# EAGLE design LinearMixer (EAGLE 9.6.1)
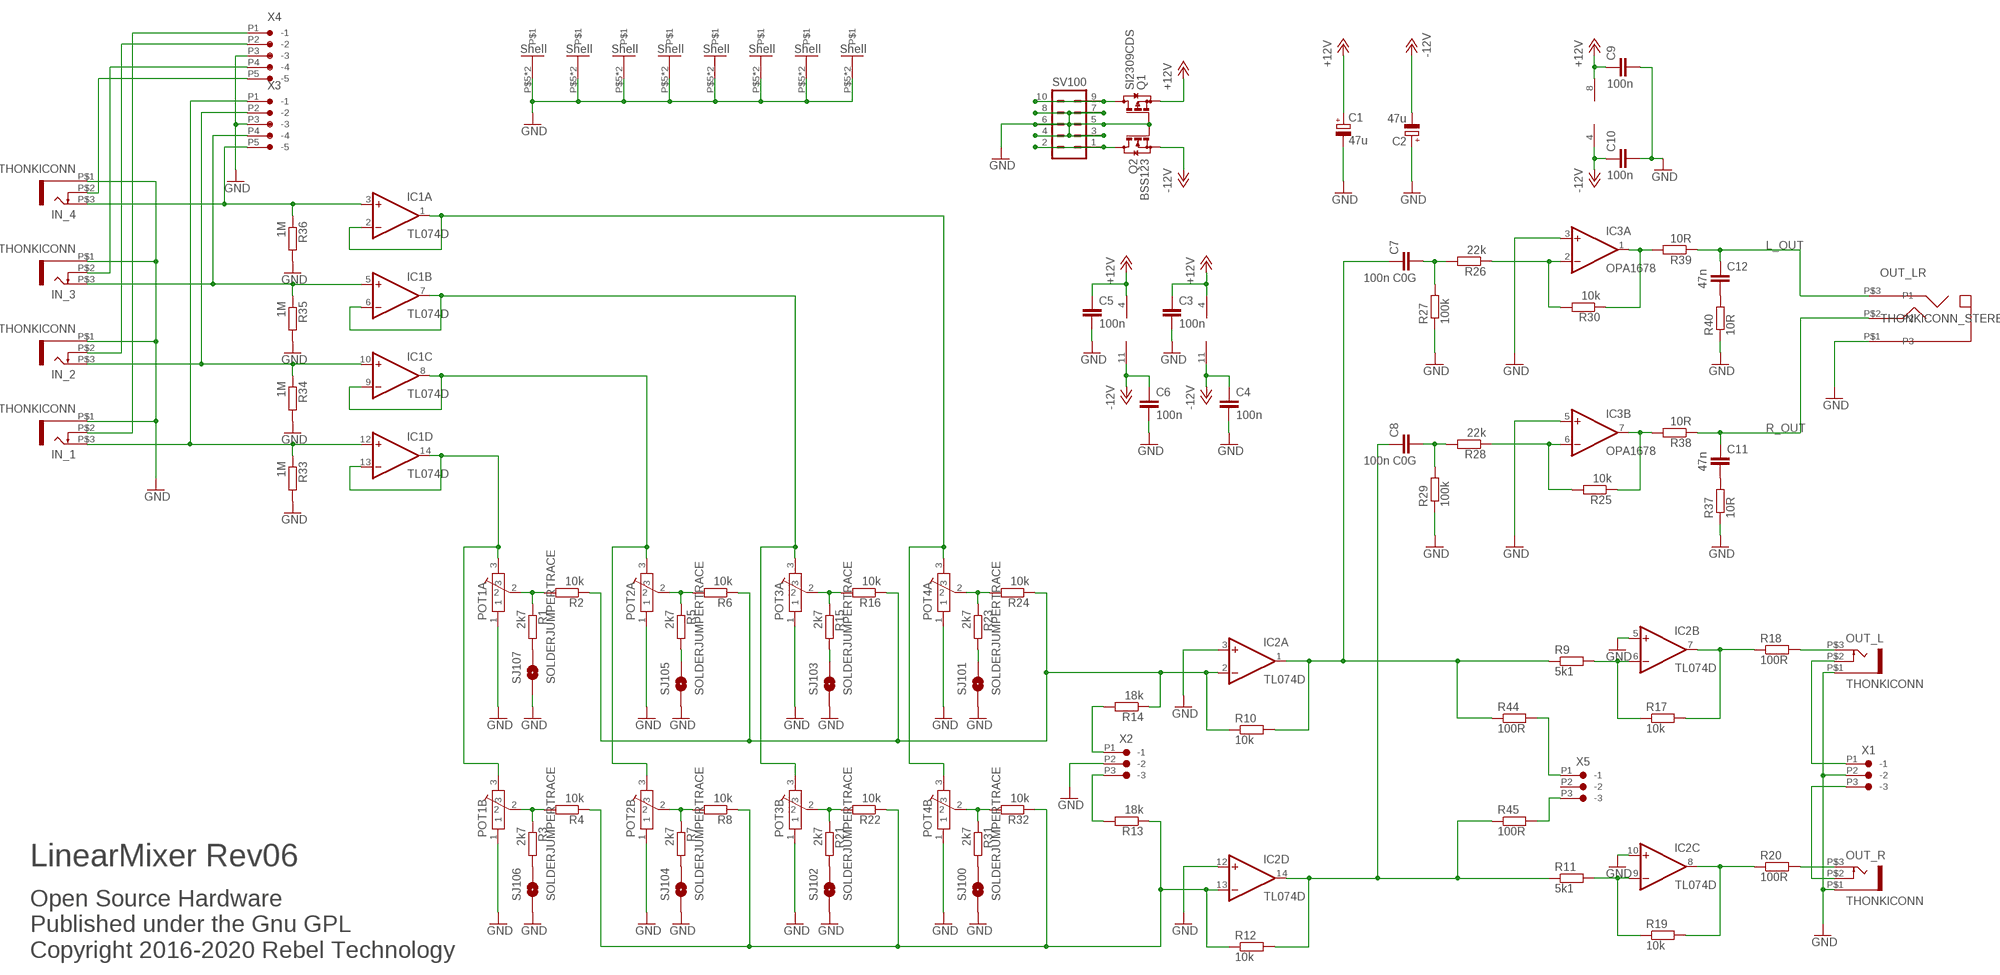
[diagram p0: schematic, sheet 1]

## Parts
C1  47u  CPOL-EU153CLV-0505  [153CLV-0505]
C2  47u  CPOL-EU153CLV-0505  [153CLV-0505]
C3  100n  C-EUC0603  [C0603]
C4  100n  C-EUC0603  [C0603]
C5  100n  C-EUC0603  [C0603]
C6  100n  C-EUC0603  [C0603]
C7  100n C0G  C-EUC1210  [C1210]
C8  100n C0G  C-EUC1210  [C1210]
C9  100n  C-EUC0603  [C0603]
C10  100n  C-EUC0603  [C0603]
C11  47n  C-EUC0603  [C0603]
C12  47n  C-EUC0603  [C0603]
IC1  TL074D  [SO14]
IC2  TL074D  [SO14]
IC3  OPA1678  NE5532D  [SO08]
IN_1  THONKICONN  [THONKICONN]
IN_2  THONKICONN  [THONKICONN]
IN_3  THONKICONN  [THONKICONN]
IN_4  THONKICONN  [THONKICONN]
OUT_L  THONKICONN  [THONKICONN]
OUT_LR  THONKICONN_STEREO  [THONKICONN_STEREO]
OUT_R  THONKICONN  [THONKICONN]
POT1A  POT-ALPS-RK09L1140  [POT-ALPS-RK09L1140]
POT1B  POT-ALPS-RK09L1140  [POT-ALPS-RK09L1140]
POT2A  POT-ALPS-RK09L1140  [POT-ALPS-RK09L1140]
POT2B  POT-ALPS-RK09L1140  [POT-ALPS-RK09L1140]
POT3A  POT-ALPS-RK09L1140  [POT-ALPS-RK09L1140]
POT3B  POT-ALPS-RK09L1140  [POT-ALPS-RK09L1140]
POT4A  POT-ALPS-RK09L1140  [POT-ALPS-RK09L1140]
POT4B  POT-ALPS-RK09L1140  [POT-ALPS-RK09L1140]
Q1  SI2309CDS  BSS84  [SOT23]
Q2  BSS123  [SOT23]
R1  2k7  R-EU_0603  [0603]
R2  10k  R-EU_0603  [0603]
R3  2k7  R-EU_0603  [0603]
R4  10k  R-EU_0603  [0603]
R5  2k7  R-EU_0603  [0603]
R6  10k  R-EU_0603  [0603]
R7  2k7  R-EU_0603  [0603]
R8  10k  R-EU_0603  [0603]
R9  5k1  R-EU_0603  [0603]
R10  10k  R-EU_0603  [0603]
R11  5k1  R-EU_0603  [0603]
R12  10k  R-EU_0603  [0603]
R13  18k  R-EU_0603  [0603]
R14  18k  R-EU_0603  [0603]
R15  2k7  R-EU_0603  [0603]
R16  10k  R-EU_0603  [0603]
R17  10k  R-EU_0603  [0603]
R18  100R  R-EU_0603  [0603]
R19  10k  R-EU_0603  [0603]
R20  100R  R-EU_0603  [0603]
R21  2k7  R-EU_0603  [0603]
R22  10k  R-EU_0603  [0603]
R23  2k7  R-EU_0603  [0603]
R24  10k  R-EU_0603  [0603]
R25  10k  R-EU_0603  [0603]
R26  22k  R-EU_0603  [0603]
R27  100k  R-EU_0603  [0603]
R28  22k  R-EU_0603  [0603]
R29  100k  R-EU_0603  [0603]
R30  10k  R-EU_0603  [0603]
R31  2k7  R-EU_0603  [0603]
R32  10k  R-EU_0603  [0603]
R33  1M  R-EU_0603  [0603]
R34  1M  R-EU_0603  [0603]
R35  1M  R-EU_0603  [0603]
R36  1M  R-EU_0603  [0603]
R37  10R  R-EU_0603  [0603]
R38  10R  R-EU_0603  [0603]
R39  10R  R-EU_0603  [0603]
R40  10R  R-EU_0603  [0603]
R44  100R  R-EU_0603  [0603]
R45  100R  R-EU_0603  [0603]
SJ100  SOLDERJUMPERTRACE  [SJ_2S-TRACE]
SJ101  SOLDERJUMPERTRACE  [SJ_2S-TRACE]
SJ102  SOLDERJUMPERTRACE  [SJ_2S-TRACE]
SJ103  SOLDERJUMPERTRACE  [SJ_2S-TRACE]
SJ104  SOLDERJUMPERTRACE  [SJ_2S-TRACE]
SJ105  SOLDERJUMPERTRACE  [SJ_2S-TRACE]
SJ106  SOLDERJUMPERTRACE  [SJ_2S-TRACE]
SJ107  SOLDERJUMPERTRACE  [SJ_2S-TRACE]
SV100  MA05-2  [MA05-2]
X1  CON-JST_PH_3W  [CON-JST_PH_3W]
X2  CON-JST_PH_3W  [CON-JST_PH_3W]
X3  CON-JST_PH_5W  [CON-JST_PH_5W]
X4  CON-JST_PH_5W  [CON-JST_PH_5W]
X5  CON-JST_PH_3W  [CON-JST_PH_3W]

## Nets
+12V: C1.+ C3.1 C5.1 C9.1 IC1.4(P:V+) IC2.4(P:V+) IC3.8(P:V+) Q1.2(S)
-12V: C2.- C4.1 C6.1 C10.1 IC1.11(P:V-) IC2.11(P:V-) IC3.4(P:V-) Q2.2(S)
GND: C1.- C2.+ C3.2 C4.2 C5.2 C6.2 C9.2 C10.2 IC2.3(A:+IN) IC2.5(B:+IN) IC2.10(C:+IN) IC2.12(D:+IN) IC3.3(A:+IN) IC3.5(B:+IN) IN_1.P$1 IN_2.P$1 IN_3.P$1 IN_4.P$1 OUT_L.P$1 OUT_LR.P$1(P3) OUT_R.P$1 POT1A.1 POT1A.P$5 POT1A.P$6 POT1B.1 POT1B.P$5 POT1B.P$6 POT2A.1 POT2A.P$5 POT2A.P$6 POT2B.1 POT2B.P$5 POT2B.P$6 POT3A.1 POT3A.P$5 POT3A.P$6 POT3B.1 POT3B.P$5 POT3B.P$6 POT4A.1 POT4A.P$5 POT4A.P$6 POT4B.1 POT4B.P$5 POT4B.P$6 Q1.1(G) Q2.1(G) R27.1 R29.1 R33.2 R34.2 R35.2 R36.2 R37.1 R40.1 SJ100.1 SJ101.1 SJ102.1 SJ103.1 SJ104.1 SJ105.1 SJ106.1 SJ107.1 SV100.3 SV100.4 SV100.5 SV100.6 SV100.7 SV100.8 X1.P2(-2) X2.P2(-2) X3.P3(-3) X4.P3(-3)
IN_1: IC1.12(D:+IN) IN_1.P$3 R33.1 X3.P1(-1)
IN_2: IC1.10(C:+IN) IN_2.P$3 R34.1 X3.P2(-2)
IN_3: IC1.5(B:+IN) IN_3.P$3 R35.1 X3.P4(-4)
IN_4: IC1.3(A:+IN) IN_4.P$3 R36.1 X3.P5(-5)
IN_A: R14.2 X2.P1(-1)
IN_B: R13.2 X2.P3(-3)
IN_SW_1: IN_1.P$2 X4.P1(-1)
IN_SW_2: IN_2.P$2 X4.P2(-2)
IN_SW_3: IN_3.P$2 X4.P4(-4)
IN_SW_4: IN_4.P$2 X4.P5(-5)
L_OUT: C12.1 OUT_LR.P$3(P1) R39.1
N$1: Q2.3(D) SV100.1 SV100.2
N$2: IC3.7(B:OUT) R25.1 R38.2
N$3: IC3.2(A:-IN) R26.1 R30.2
N$4: C8.2 R28.2 R29.2
N$5: IC2.8(C:OUT) R19.2 R20.1
N$6: IC2.7(B:OUT) R17.2 R18.1
N$7: IC2.13(D:-IN) R4.1 R8.1 R12.1 R13.1 R22.1 R32.1
N$8: C7.2 R26.2 R27.2
N$9: OUT_L.P$3 R18.2
N$10: C8.1 IC2.14(D:OUT) R11.1 R12.2 R45.1
N$11: IC2.2(A:-IN) R2.1 R6.1 R10.1 R14.1 R16.1 R24.1
N$12: C11.2 R37.2
N$13: C7.1 IC2.1(A:OUT) R9.1 R10.2 R44.1
N$14: Q1.3(D) SV100.9 SV100.10
N$15: OUT_R.P$3 R20.2
N$16: IC3.6(B:-IN) R25.2 R28.1
N$17: R1.2 SJ107.2
N$18: IC2.6(B:-IN) R9.2 R17.1
N$19: IC3.1(A:OUT) R30.1 R39.2
N$20: POT1B.2 R3.1 R4.2
N$21: C12.2 R40.2
N$22: R5.2 SJ105.2
N$23: IC2.9(C:-IN) R11.2 R19.1
N$24: R15.2 SJ103.2
N$25: R23.2 SJ101.2
N$26: R3.2 SJ106.2
N$27: IC1.8(C:OUT) IC1.9(C:-IN) POT2A.3 POT2B.3
N$28: R7.2 SJ104.2
N$29: POT1A.2 R1.1 R2.2
N$30: POT2B.2 R7.1 R8.2
N$31: POT3B.2 R21.1 R22.2
N$32: R21.2 SJ102.2
N$33: R31.2 SJ100.2
N$34: IC1.13(D:-IN) IC1.14(D:OUT) POT1A.3 POT1B.3
N$44: POT4B.2 R31.1 R32.2
N$47: POT4A.2 R23.1 R24.2
N$49: POT3A.2 R15.1 R16.2
N$51: POT2A.2 R5.1 R6.2
N$53: IC1.6(B:-IN) IC1.7(B:OUT) POT3A.3 POT3B.3
N$58: IC1.1(A:OUT) IC1.2(A:-IN) POT4A.3 POT4B.3
OUT_NS_L: R44.2 X5.P1(-1)
OUT_NS_R: R45.2 X5.P3(-3)
OUT_SW_A: OUT_L.P$2 X1.P1(-1)
OUT_SW_B: OUT_R.P$2 X1.P3(-3)
R_OUT: C11.1 OUT_LR.P$2(P2) R38.1
Unconnected: X5.P2(-2)

## Notes on the sheet
- LinearMixer Rev06
- Open Source Hardware
  Published under the Gnu GPL
  Copyright 2016-2020 Rebel Technology

## Library data of the parts
C1 C2 = rcl:CPOL-EU: POLARIZED CAPACITOR, European symbol; SPICEPREFIX: C
C3-C12 = Rebel:C-EU: CAPACITOR, European symbol
IC1 IC2 = Rebel:TL074: OP AMP
IC3 = Rebel:NE5532: AUDIO AMPLIFIER
IN_1-IN_4 OUT_L OUT_R = Rebel:THONKICONN
OUT_LR = Rebel:THONKICONN_STEREO
POT1A POT1B POT2A POT2B POT3A POT3B POT4A POT4B = Rebel:POT-ALPS-RK09L
Q1 = transistor-small-signal:BSS84: P-CHANNEL MOS FET
Q2 = transistor-small-signal:BSS123: N-CHANNEL MOS FET
R1-R40 R44 R45 = Rebel:R-EU_: RESISTOR, European symbol
SJ100-SJ107 = SparkFun:SOLDERJUMPER: Solder Jumper Standard SMD solder jumper. Used to automate production. Two varients : Normally Open and Normally Closed are the same, but have different paste layers. NC will have a large amount of paste and should jumper during reflow.
SV100 = Rebel:MA05-2: PIN HEADER; OC_FARNELL: unknown; OC_NEWARK: unknown
X1 X2 X5 = Rebel:CON-JST_PH_3W
X3 X4 = Rebel:CON-JST_PH_5W

## Board
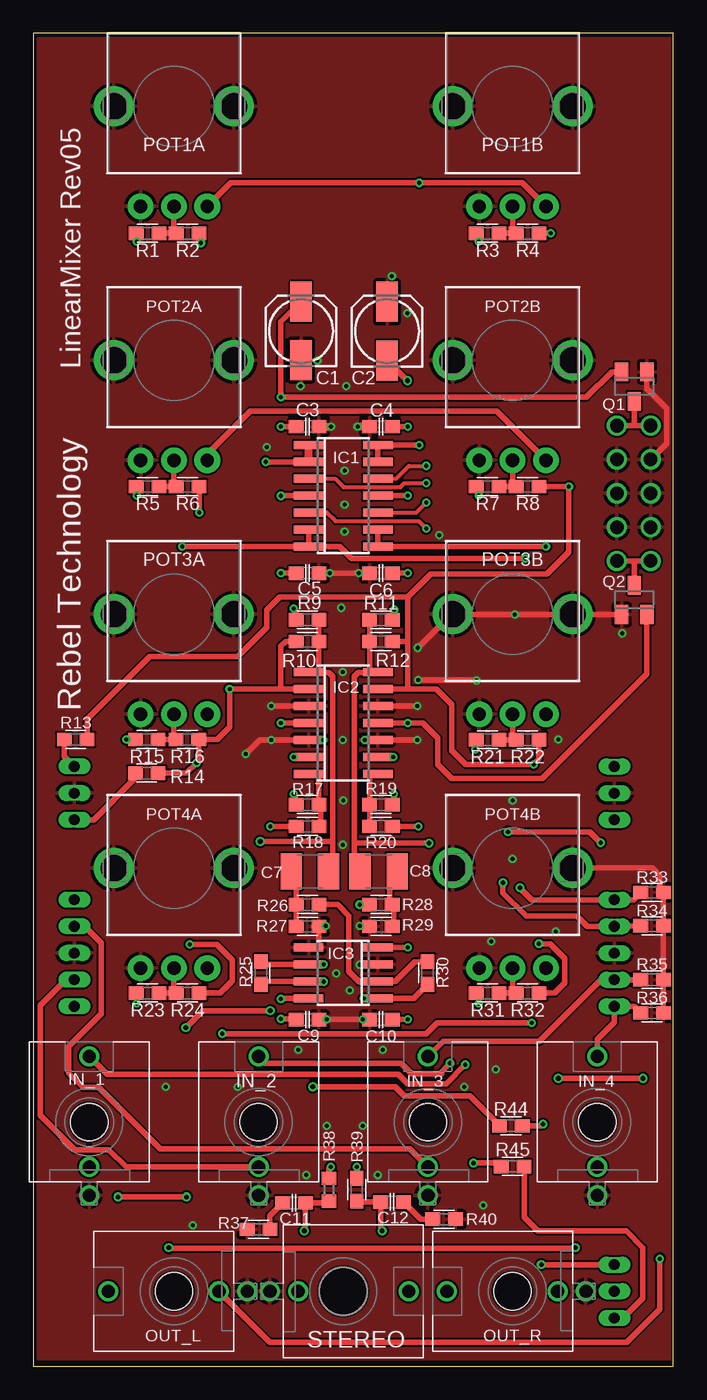
[diagram p1: board, top side]
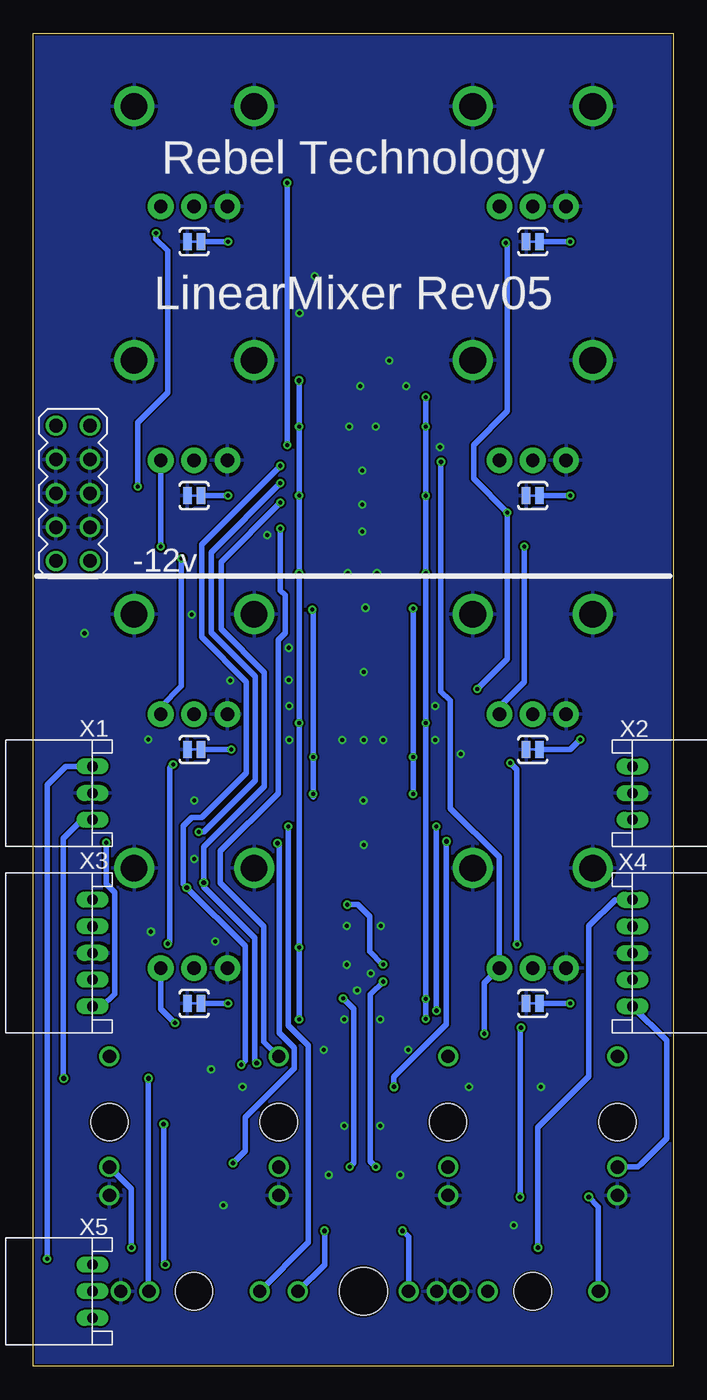
[diagram p2: board, bottom side, seen from below]

Size 48 x 100 mm. Coordinates in mm from the lower left corner, seen from the top.
Outline: 48,0 48,100 0,100 0,0 48,0
Copper layers (1*16): Top 0.035mm / dielectric 1.5mm / Bottom 0.035mm
Design rules "SparkFun-2-layer-PCBWay-LIMIT *": minimum track width 6mil, minimum drill 0.3mm, track to track 6mil, track to pad 6mil, pad to pad 6mil, via to via 6mil, smd to smd 0mil, copper to edge 6mil, drill to drill 6mil, minimum pad ring 6mil, minimum via ring 6mil, stop-mask expansion 4mil, vias tented up to drill 25mil, thermal gap 10mil

### Footprints (pad centres in the part's own frame; a part is rotated, then mirrored left to right if it is on the bottom)
153CLV-0505 = smd 3 x 1.6: + 2.2,0; - -2.2,0
C0603 = smd 1.1 x 1: 1 -0.85,0; 2 0.85,0
C1210 = smd 1.6 x 2.7: 1 -1.4,0; 2 1.4,0
SO14 = smd 0.6 x 2.2: 1 -3.81,-2.6; 2 -2.54,-2.6; 3 -1.27,-2.6; 4 0,-2.6; 5 1.27,-2.6; 6 2.54,-2.6; 7 3.81,-2.6; 8 3.81,2.6; 9 2.54,2.6; 10 1.27,2.6; 11 0,2.6; 12 -1.27,2.6; 13 -2.54,2.6; 14 -3.81,2.6
SO08 = smd 0.6 x 2.2: 1 -1.905,-2.6; 2 -0.635,-2.6; 3 0.635,-2.6; 4 1.905,-2.6; 5 1.905,2.6; 6 0.635,2.6; 7 -0.635,2.6; 8 -1.905,2.6
THONKICONN = drill 1: P$1 0,-5.5; P$2 0,-3.38; P$3 0,4.92 | hole 2.8: 0,0
THONKICONN_STEREO = drill 1: P$1 0,-5.5; P$2 0,-3.38; P$3 0,4.92 | hole 3.6: 0,0
POT-ALPS-RK09L1140 = drill 1 pad 1.93: 1 -2.5,-7.5; 2 0,-7.5; 3 2.5,-7.5 | drill 2: P$5 -4.5,0; P$6 4.5,0
SOT23 = smd 1 x 1.4: 1 -0.95,-1.1; 2 0.95,-1.1; 3 0,1.1
0603 = smd 1.1 x 1: 1 -0.85,0; 2 0.85,0
R0603 = smd 1 x 1.1: 1 -0.85,0; 2 0.85,0
SJ_2S-TRACE = smd 0.635 x 1.27: 1 -0.508,0; 2 0.508,0
MA05-2 = drill 1.016: 1 -5.08,-1.27; 2 -5.08,1.27; 3 -2.54,-1.27; 4 -2.54,1.27; 5 0,-1.27; 6 0,1.27; 7 2.54,-1.27; 8 2.54,1.27; 9 5.08,-1.27; 10 5.08,1.27
CON-JST_PH_3W = drill 0.8 long: P1 0,0; P2 -2,0; P3 -4,0
CON-JST_PH_5W = drill 0.8 long: P1 0,0; P2 -2,0; P3 -4,0; P4 -6,0; P5 -8,0

### Placement (x,y rotation side)
C1  10u  [153CLV-0505]  20.08,77.66 90 top
C2  10u  [153CLV-0505]  26.53,77.66 90 top
C3  20.57,70.5 0 top
C4  26.07,70.5 180 top
C5  20.57,59.5 0 top
C6  26.07,59.5 180 top
C7  1u Polyester  [C1210]  20.74,37.13 180 top
C8  1u Polyester  [C1210]  25.9,37.13 0 top
C9  20.57,26 0 top
C10  26.07,26 180 top
C11  19.56,12.25 180 top
C12  26.91,12.32 0 top
IC1  23.24,65.31 270 top
IC2  23.24,48.26 270 top
IC3  OPA1648  [SO08]  23.24,29.5 90 top
IN_1  4.19,18.32 0 top
IN_2  16.89,18.32 0 top
IN_3  29.59,18.32 0 top
IN_4  42.29,18.32 0 top
OUT_L  10.54,5.62 90 top
OUT_LR  23.24,5.62 270 top
OUT_R  35.94,5.62 90 top
POT1A  10.54,94.52 0 top
POT1B  35.94,94.52 0 top
POT2A  10.54,75.47 0 top
POT2B  35.94,75.47 0 top
POT3A  10.54,56.42 0 top
POT3B  35.94,56.42 0 top
POT4A  10.54,37.37 0 top
POT4B  35.94,37.37 0 top
Q1  45.07,73.5 180 top
Q2  45.07,57.5 0 top
R1  8.57,85 180 top
R2  11.57,85 180 top
R3  34.07,85 180 top
R4  37.07,85 180 top
R5  8.57,66 180 top
R6  11.57,66 180 top
R7  34.07,66 180 top
R8  37.07,66 180 top
R9  20.57,56 180 top
R10  20.57,54.37 0 top
R11  26.07,56 0 top
R12  26.07,54.37 180 top
R13  3.17,47.02 180 top
R14  8.5,44.5 180 top
R15  8.51,47.02 180 top
R16  11.56,47.02 180 top
R17  20.57,42.13 0 top
R18  1k  [0603]  20.57,40.5 180 top
R19  26.07,42.13 180 top
R20  1k  [0603]  26.07,40.5 0 top
R21  34.07,47 180 top
R22  37.07,47 180 top
R23  8.57,28 180 top
R24  11.57,28 180 top
R25  17.07,29.5 90 top
R26  20.57,34.63 180 top
R27  20.57,33 180 top
R28  26.07,34.63 0 top
R29  26.07,33 0 top
R30  29.57,29.5 90 top
R31  34.07,28 180 top
R32  37.07,28 180 top
R33  46.4,35.54 0 top
R34  46.4,33.04 0 top
R35  46.4,29 0 top
R36  46.4,26.5 0 top
R37  16.89,10.26 0 top
R38  22R  [R0603]  22.17,13.24 90 top
R39  22R  [0603]  24.26,13.24 90 top
R40  30.81,11.03 180 top
R44  1k  [0603]  35.81,18.03 0 top
R45  1k  [0603]  35.94,14.99 0 top
SJ100  35.94,27.21 0 bottom
SJ101  10.54,27.21 0 bottom
SJ102  35.94,46.26 0 bottom
SJ103  10.54,46.26 0 bottom
SJ104  35.94,65.31 0 bottom
SJ105  10.54,65.31 0 bottom
SJ106  35.94,84.36 0 bottom
SJ107  10.54,84.36 0 bottom
SV100  45.03,65.49 90 bottom
X1  43.57,45 90 bottom
X2  3.07,41 270 bottom
X3  43.57,35 90 bottom
X4  3.07,27 270 bottom
X5  43.57,7.62 90 bottom

### Tracks (layer width: path | path; a pad name or v marks a point on that pad's centre or on a via)
+12V  (via drill 0.3)
  Top 0.305: 20.07,70.48 C3.1
  Top 0.406: v18.57,48.26 IC2.4 | C5.1 v18.57,59.5 | C3.1 v18.57,70.5 | IC1.4 v18.58,65.31 v18.57,65.3 | Q1.2 43.37,74.6 41.47,72.7 v18.57,72.7 18.57,78.35 C1.+ | v18.57,26.05 19.67,26.05 C9.1 | IC3.8 18.61,27.59 v18.57,27.55
  Bottom 0.406: v18.57,72.7 v18.57,70.5 v18.57,65.3 v18.57,59.5 v18.57,48.26 v18.57,27.55 v18.57,26.05
-12V  (via drill 0.3, 0.35)
  Top 0.406: IC1.11 v28.07,65.31 | C4.1 v28.07,70.5 | C6.1 v28.06,59.5 v28.07,59.51 | IC2.11 v28.07,48.26 | v28.07,48.26 | v28.07,48.26 29.22,48.26 30.32,47.15 30.32,45.14 31.37,44.09 38.16,44.09 46.02,51.95 Q2.2 | v28.07,26.01 26.93,26.01 C10.1 | IC3.4 v28.07,31.41 | C2.- 28.05,73.95 v28.07,73.95
  Bottom 0.406: v28.07,26.01 v28.07,31.41 v28.07,48.26 v28.07,59.51 v28.07,65.31 v28.07,70.5 v28.07,73.94 v28.07,73.95
GND  (via drill 0.3)
  Top 0.406: C5.2 v22.23,59.5 v24.42,59.5 C6.2 | IC2.3 v17.84,49.52 | POT4B.P$6 46.45,37.37 46.99,36.83 46.99,35.8 R33.2 R34.2 R35.2 R36.2 | v28.79,46.98 IC2.10 | Q2.1 40.46,56.4 POT3B.P$6 | C9.2 21.97,26 v21.99,26.02 v24.69,26.02 24.77,25.95 25.22,25.95 C10.2 | v21.94,33.02 21.92,33 R27.1 21.42,31.55 21.32,31.45 20.69,31.45 IC3.5 | R29.1 24.77,33 | IC3.3 24.75,30.14 | v28.84,53.9 31.34,56.4 | 40.42,56.4 v36.12,56.4 31.52,56.4 | v15.94,45.94 16.97,46.98 v17.84,46.98 17.85,46.98 IC2.5 | v28.86,51.49 33.17,51.49 v33.24,51.43 | v28.79,49.52 IC2.12 | SV100.8 47.5,69.23 47.5,71.85 46.02,73.33 Q1.1
  Top 0.61: C4.2 v24.32,70.5 | C3.2 v22.32,70.5
  other vias: 24.49,30.12 24.49,33.02 35.94,38.06 39.18,32.6 21.74,46.98 24.84,46.98 24.69,18.02 21.99,18.02 25.84,14.34 20.47,14.34 9.93,20.95 15.33,20.95 32.31,20.95 11.96,10.58 33.74,12.05 23.24,42.45 35.94,42.45 23.72,28.2 22.71,29.47 23.21,39.12 23.21,46.99 23.21,52.08 23.09,56.9 23.34,62.62 23.34,64.65 23.34,67.19 17.5,68.97 23.47,73.54 30.45,62.36 34.67,22.26 26.22,23.74 19.87,23.74 34.35,31.87 39.37,47.02 20.04,73.54 21.31,75.44 26.9,81.79 28.04,79 44.16,54.99
  pour Bottom: -0.89,-0.73 49.91,-0.73 49.91,100.87 -0.89,100.87
  pour Top: 0.38,0.54 51.18,0.54 51.18,99.6 0.38,99.6
IN_1  (via drill 0.3, 0.35)
  Top 0.305: IC1.12 27.2,66.58 28.17,67.55 v29.47,67.55
  Top 0.406: IN_1.P$3 5.53,21.9 27.37,21.9 28.07,21.2 30.97,21.2 v32.4,22.63 | R33.1 45.01,35 X3.P1 37.39,35 v36.5,35.89
  Bottom 0.406: v29.47,67.55 35.37,61.65 35.37,54.7 32.02,51.35 32.02,44.5 35.35,41.17 36.12,41.17 36.77,40.52 36.77,36.17 v36.5,35.89 32.12,31.52 32.12,22.9 v32.4,22.63
IN_2  (via drill 0.3, 0.35)
  Top 0.305: IC1.10 28.71,64.04 v29.47,64.8
  Top 0.406: IN_2.P$3 17.4,22.73 27.59,22.73 28.37,21.95 30.48,21.95 | 30.48,21.95 30.62,21.95 | R34.1 43.61,33.04 X3.P2 41.54,33 40.77,33.77 36.97,33.77 35.22,35.52 v35.22,36.28 | 30.48,21.95 31.24,22.71 v31.24,22.73
  Bottom 0.406: v29.47,64.8 33.92,60.35 33.92,55.3 30.67,52.05 30.67,43.5 35.22,38.95 v35.22,36.28 35.22,35.96 31.4,32.14 31.4,22.89 v31.24,22.73
IN_3  (via drill 0.3)
  Top 0.305: IC1.5 22.02,64.05 22.67,63.4 28.92,63.4 v29.47,62.85
  Top 0.406: 45.36,29.19 R35.1 X3.P4 42.55,29 37.94,24.38 30.73,24.38 IN_3.P$3
  Bottom 0.406: v29.47,62.85 29.47,58.2 29.12,57.85 29.12,55 29.64,54.48 29.64,42.97 33.97,38.64 33.97,36.26 30.71,33 30.71,24.34 29.61,23.24 IN_3.P$3
IN_4  (via drill 0.3)
  Top 0.305: IC1.3 22.64,66.58 23.27,65.95 27.52,65.95 27.82,66.25 v29.47,66.25
  Top 0.406: v35.6,40.09 41.73,40.09 v42.55,39.27 | R36.1 45.05,27 X3.P5 43.57,25.79 42.29,24.51 IN_4.P$3
  Bottom 0.406: v29.47,66.25 34.67,61.05 34.67,55.05 31.37,51.75 31.37,43.95 35.23,40.09 v35.6,40.09 | v42.55,39.27 42.55,36.2 41.91,35.56 41.91,27.94 42.85,27 X3.P5
IN_A
  Top 0.406: X2.P1 4.52,41 7.65,44.13 R14.2
IN_B
  Top 0.406: X2.P3 2.33,45.75 R13.2
IN_SW_1
  Bottom 0.406: X4.P1 0.51,24.43 0.51,17.1 2.45,15.15 2.66,14.95 2.67,14.94 IN_1.P$2
IN_SW_2
  Top 0.406: IN_2.P$2 10.48,14.94 10.47,14.95 6.97,14.95 5.67,16.25 3.09,16.25 0.51,18.83 0.51,27.07 2.44,29 X4.P2
IN_SW_3
  Top 0.406: IN_3.P$2 28.23,16.3 9.51,16.3 4.9,20.91 3.73,20.91 2.67,21.97 2.67,24 5.08,26.42 5.08,31.75 3.81,33.02 3.09,33.02 X4.P4
IN_SW_4  (via drill 0.35)
  Top 0.406: v10.16,8.89 10.19,8.86 40.61,8.86 v40.64,8.89
  Bottom 0.406: X4.P5 4.37,35 6.35,33.02 6.35,21.74 10.16,17.93 v10.16,8.89 | v40.64,8.89 40.64,13.29 IN_4.P$2
L_OUT  (via drill 0.35)
  Top 0.406: 24.33,12.32 R39.1 24.33,12.32 C12.1 26.06,10.26 v26.16,10.16
  Bottom 0.406: v26.16,10.16 26.16,7.62 OUT_LR.P$3
N$1
  Top 0.406: SV100.1 45.07,60.41 | 45.07,60.41 SV100.2 | Q2.3 45.07,60.41
N$2  (via drill 0.3)
  Top 0.406: R25.1 17.29,28.86 IC3.7 21.76,28.86 v21.77,28.85 | v22.3,14.96 22.17,14.83 R38.2
  Bottom 0.406: v21.77,28.85 22.72,27.9 22.72,15.38 v22.3,14.96
N$3
  Top 0.406: R26.1 22.82,34.63 23.67,33.77 23.67,29.6 24.43,28.85 25.83,28.85 IC3.2 27.14,28.86 28.62,30.35 R30.2
N$4
  Top 0.406: R29.2 26.92,32.95 27.02,32.85 27.02,34.53 R28.2 26.77,34.63 26.72,34.58 26.72,36.55 C8.2
N$5
  Top 0.406: R20.1 R19.2 25.22,44.35 25.32,44.45 IC2.8
N$6
  Top 0.406: R18.1 21.57,40.5 21.57,41.98 R17.2 21.42,44.35 21.32,44.45 IC2.7
N$7  (via drill 0.3)
  Top 0.406: R12.1 28.07,54.37 | 28.07,54.37 28.07,50.8 IC2.13 30.23,50.8 31.37,49.65 31.37,46.2 32.43,45.14 v37.52,45.14 37.92,45.54 R22.1 | 38.41,28 R32.1 39.12,28 39.87,28.75 39.87,30.6 38.77,31.7 v37.92,31.7 | R4.1 v38.8,85 | R8.1 v40.17,66 40.17,61.1 38.49,59.42 29.79,59.42 28.07,57.7 | 28.07,54.37 28.07,57.7 | 28.07,57.7 18.47,57.7 17.52,56.75 17.52,55.43 15.35,53.25 8.73,53.25 4.03,48.55 R13.1
  Bottom 0.406: v37.52,45.14 37.77,44.89 37.77,31.85 v37.92,31.7 | v40.17,66 40.17,70.8 37.92,73.05 37.92,83.69 38.8,84.57 v38.8,85
N$8
  Top 0.406: C7.2 19.72,36.75 R26.2 R27.2
N$9  (via drill 0.3, 0.35)
  Top 0.406: R18.2 v17.77,40.5 | v11.43,25.4 12.7,26.67 v17.77,26.67 | v6.35,12.7 v11.49,12.7
  Bottom 0.406: v17.77,40.5 v17.77,26.67 17.77,26.55 | v11.43,25.4 11.49,25.34 v11.49,12.7 | OUT_L.P$3 5.62,11.97 v6.35,12.7
N$10  (via drill 0.35)
  Top 0.406: 25.22,52.15 25.37,52 25.44,52.06 IC2.14 | C8.1 24.15,37.13 24.07,37.05 24.07,39.24 | 24.07,39.24 24.07,51.75 24.37,52.05 25.02,52.05 | 25.02,52.05 25.07,52 | 25.02,52.05 25.12,52.05 25.22,52.15 | 25.22,52.15 R12.2 R11.1 | 24.07,39.24 v29.68,39.24 | v33.02,15.24 34.84,15.24 R45.1
  Bottom 0.406: v29.68,39.24 29.55,39.12 29.55,25.02 28.43,23.9 28.43,22.34 32.11,18.67 32.11,16.15 v33.02,15.24
N$11  (via drill 0.3)
  Top 0.406: IC2.2 18.57,50.8 | 18.57,50.8 14.77,50.8 | R10.1 18.92,54.37 18.57,54.02 18.57,50.8 | v12.45,64.04 12.45,65.97 R6.1 | 14.77,50.8 14.72,50.74 14.72,47.95 13.79,47.02 R16.1 12.41,45.43 v12.24,45.26 11.48,44.5 R14.1 | 14.77,50.8 v14.73,50.8 v14.72,50.8 | v11.72,31.65 13.77,31.65 14.92,30.5 14.92,28.9 14.02,28 R24.1 | v12.57,84.27 12.42,84.42 R2.1
  Bottom 0.406: v14.72,50.8 12.45,53.08 v12.45,64.04 14.99,66.58 14.99,69.12 12.45,71.66 12.45,84.15 v12.57,84.27 | v11.72,31.65 v11.73,31.66 11.73,44.75 v12.24,45.26
N$12
  Top 0.406: R37.2 17.74,11.29 C11.2
N$13  (via drill 0.35)
  Top 0.406: 21.17,52.1 21.42,52.35 R10.2 R9.1 | 21.17,52.1 21.07,52 20.71,52 IC2.1 | 21.17,52.1 21.22,52.05 22.17,52.05 22.47,51.75 22.47,39.37 | C7.1 22.47,37.45 22.47,39.37 | 22.47,39.37 v17.02,39.37 | v20.95,20.96 27.14,20.96 27.82,20.29 32.71,20.29 R44.1
  Bottom 0.406: v17.02,39.37 17.02,25.65 18.54,24.13 20.95,21.72 v20.95,20.96
N$14
  Top 0.406: SV100.9 45.07,70.57 | 45.07,70.57 SV100.10 | Q1.3 45.07,70.57
N$15  (via drill 0.3)
  Top 0.406: R20.2 v28.87,40.5
  Bottom 0.406: OUT_R.P$3 27.36,9.28 27.36,24.05 28.87,25.56 v28.87,40.5
N$16  (via drill 0.3)
  Top 0.406: R28.1 v24.47,34.63 | v21.77,30.15 21.76,30.14 IC3.6 17.29,30.14 R25.2
  Bottom 0.406: v21.77,30.15 21.81,30.15 22.77,31.11 22.77,33.73 23.67,34.63 v24.47,34.63
N$17  (via drill 0.3)
  Top 0.406: v7.75,84.36 7.75,84.97 R1.2
  Bottom 0.406: SJ107.2 v7.75,84.36
N$18  (via drill 0.3)
  Top 0.406: IC2.6 19.54,45.72 v19.52,45.7 | R17.1 19.72,42.43 v19.52,42.93 | v19.52,56.85 19.72,56.65 R9.2
  Bottom 0.406: v19.52,42.93 v19.52,45.7 v19.52,56.85
N$19  (via drill 0.3)
  Top 0.406: R30.1 28.52,27.59 IC3.1 v24.78,27.59 v24.77,27.6 | R39.2 v24.26,14.96
  Bottom 0.406: v24.77,27.6 23.97,26.8 23.97,15.25 v24.26,14.96
N$20
  Top 0.406: R3.1 R4.2 35.94,85 POT1B.2
N$21
  Top 0.406: C12.2 29.05,11.03 R40.2
N$22  (via drill 0.3)
  Top 0.406: v7.75,65.31 7.75,65.97 R5.2
  Bottom 0.406: SJ105.2 v7.75,65.31
N$23  (via drill 0.3)
  Top 0.406: R11.2 26.92,56.35 v27.07,56.75 | v27.01,45.72 26.79,45.72 26.77,45.7 25.86,45.7 IC2.9 | v27.02,42.93 27.02,42.23 R19.1
  Bottom 0.406: v27.07,56.75 27.01,56.44 v27.01,45.72 27.01,42.69 v27.02,42.93
N$24  (via drill 0.3)
  Top 0.406: v6.99,47.02 R15.2
  Bottom 0.406: SJ103.2 7.75,46.26 v6.99,47.02
N$25  (via drill 0.3)
  Top 0.406: v7.75,27.21 7.75,27.97 R23.2
  Bottom 0.406: SJ101.2 v7.75,27.21
N$26  (via drill 0.3)
  Top 0.406: v33.4,84.36 33.4,84.82 R3.2
  Bottom 0.406: SJ106.2 v33.4,84.36
N$27  (via drill 0.3)
  Top 0.406: IC1.9 IC1.8 v38.45,61.5 | POT2A.3 13.04,68.44 16.26,71.66 34.75,71.66 POT2B.3
  Bottom 0.406: POT2B.3 38.44,62.09 v38.45,61.5
N$28  (via drill 0.3)
  Top 0.406: v33.4,65.31 33.4,65.82 R7.2
  Bottom 0.406: SJ104.2 v33.4,65.31
N$29
  Top 0.406: R1.1 R2.2 10.54,85 POT1A.2
N$30
  Top 0.406: R7.1 R8.2 35.94,66 POT2B.2
N$31
  Top 0.406: R21.1 R22.2 35.94,47.28 POT3B.2
N$32  (via drill 0.3)
  Top 0.406: v33.15,46.26 33.15,46.93 R21.2
  Bottom 0.406: SJ102.2 v33.15,46.26
N$33  (via drill 0.3)
  Top 0.406: v33.4,27.21 33.4,27.82 R31.2
  Bottom 0.406: SJ100.2 v33.4,27.21
N$34  (via drill 0.3)
  Top 0.305: POT1A.3 13.04,86.94
  Top 0.406: IC1.13 IC1.14 v28.96,69.12 | POT1A.3 14.8,88.78 v28.96,88.78 36.69,88.78 POT1B.3
  Bottom 0.406: v28.96,69.12 v28.96,88.78
N$44
  Top 0.406: R31.1 R32.2 35.94,28.28 POT4B.2
N$47
  Top 0.406: R23.1 R24.2 10.54,28.18 POT4A.2
N$49
  Top 0.406: R15.1 R16.2 10.54,47.19 POT3A.2
N$51
  Top 0.406: R5.1 R6.2 10.54,66.18 POT2A.2
N$53  (via drill 0.3)
  Top 0.406: IC1.7 IC1.6 | v11.18,61.5 IC1.7 | IC1.7 22.97,61.5 23.87,60.6 v36.89,60.6
  Bottom 0.406: POT3A.3 13.04,49.48 11.18,51.34 v11.18,61.5 | POT3B.3 38.44,49.48 36.89,51.02 v36.89,60.6
N$58  (via drill 0.3)
  Top 0.406: v17.43,67.85 IC1.2 | v14.17,24.95 29.48,24.95 30.28,25.76 v37.38,25.76
  Top 0.61: IC1.2 IC1.1
  Bottom 0.254: 16.72,49.83 16.72,49.93
  Bottom 0.406: v17.43,67.85 17.43,50.63 16.72,49.93 | POT4B.3 38.44,26.82 v37.38,25.76 | 16.72,49.83 16.72,41.85 13.07,38.2 13.07,29.9 POT4A.3 14.17,28.74 v14.17,24.95
OUT_NS_L  (via drill 0.35)
  Top 0.406: R44.2 38.1,18.03 v38.23,18.16 | v38.1,7.62 X5.P1
  Bottom 0.406: v38.23,18.16 38.23,7.75 v38.1,7.62
OUT_NS_R
  Top 0.406: R45.2 36.83,14.95 36.83,11.18 37.85,10.16 44.45,10.16 45.72,8.89 45.72,5.08 44.26,3.62 X5.P3
OUT_SW_A  (via drill 0.3)
  Top 0.406: v46.97,8.07 46.97,4.26 44.52,1.81 17.73,1.81 OUT_L.P$2
  Bottom 0.406: X1.P1 45.57,45 46.97,43.6 v46.97,8.07
OUT_SW_B  (via drill 0.35)
  Top 0.406: v45.72,21.59 v39.37,21.59
  Bottom 0.406: v39.37,21.59 39.37,5.67 OUT_R.P$2 | X1.P3 44.37,41 45.77,39.6 45.77,21.64 v45.72,21.59
R_OUT  (via drill 0.35)
  Top 0.406: R38.1 22.03,12.26 C11.1 20.41,10.24 v20.32,10.16
  Bottom 0.406: OUT_LR.P$2 19.86,9.7 v20.32,10.16

### Text on the board
tPlace: LinearMixer Rev05 | Rebel Technology | STEREO
bPlace: Rebel Technology | LinearMixer Rev05 | -12v